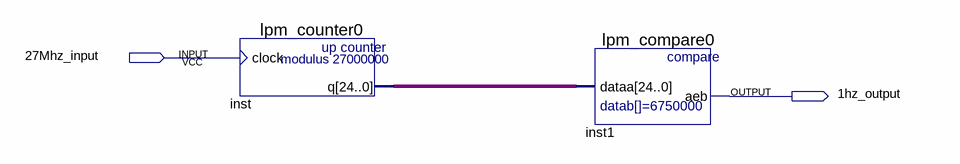
[diagram p0: schematic sheet]
// Quartus schematic clock_27mhz.bdf as structural Verilog: 2 symbols, 2 pins
module clock_27mhz (
  input  \27Mhz_input ,
  output \1hz_output 
);

  wire [24:0] inst_q;

  lpm_counter0 inst (.clock(\27Mhz_input ), .q(inst_q));
  lpm_compare0 inst1 (.dataa(inst_q), .aeb(\1hz_output ));
endmodule
